# Altium schematic sheet Microcontroller.SchDoc: Micrcontroller (RP2350B)
size B; DrawnBy: Samyar Sadat Akhavi; Revision: 1.0; SheetNumber: 3; SheetTotal: 13
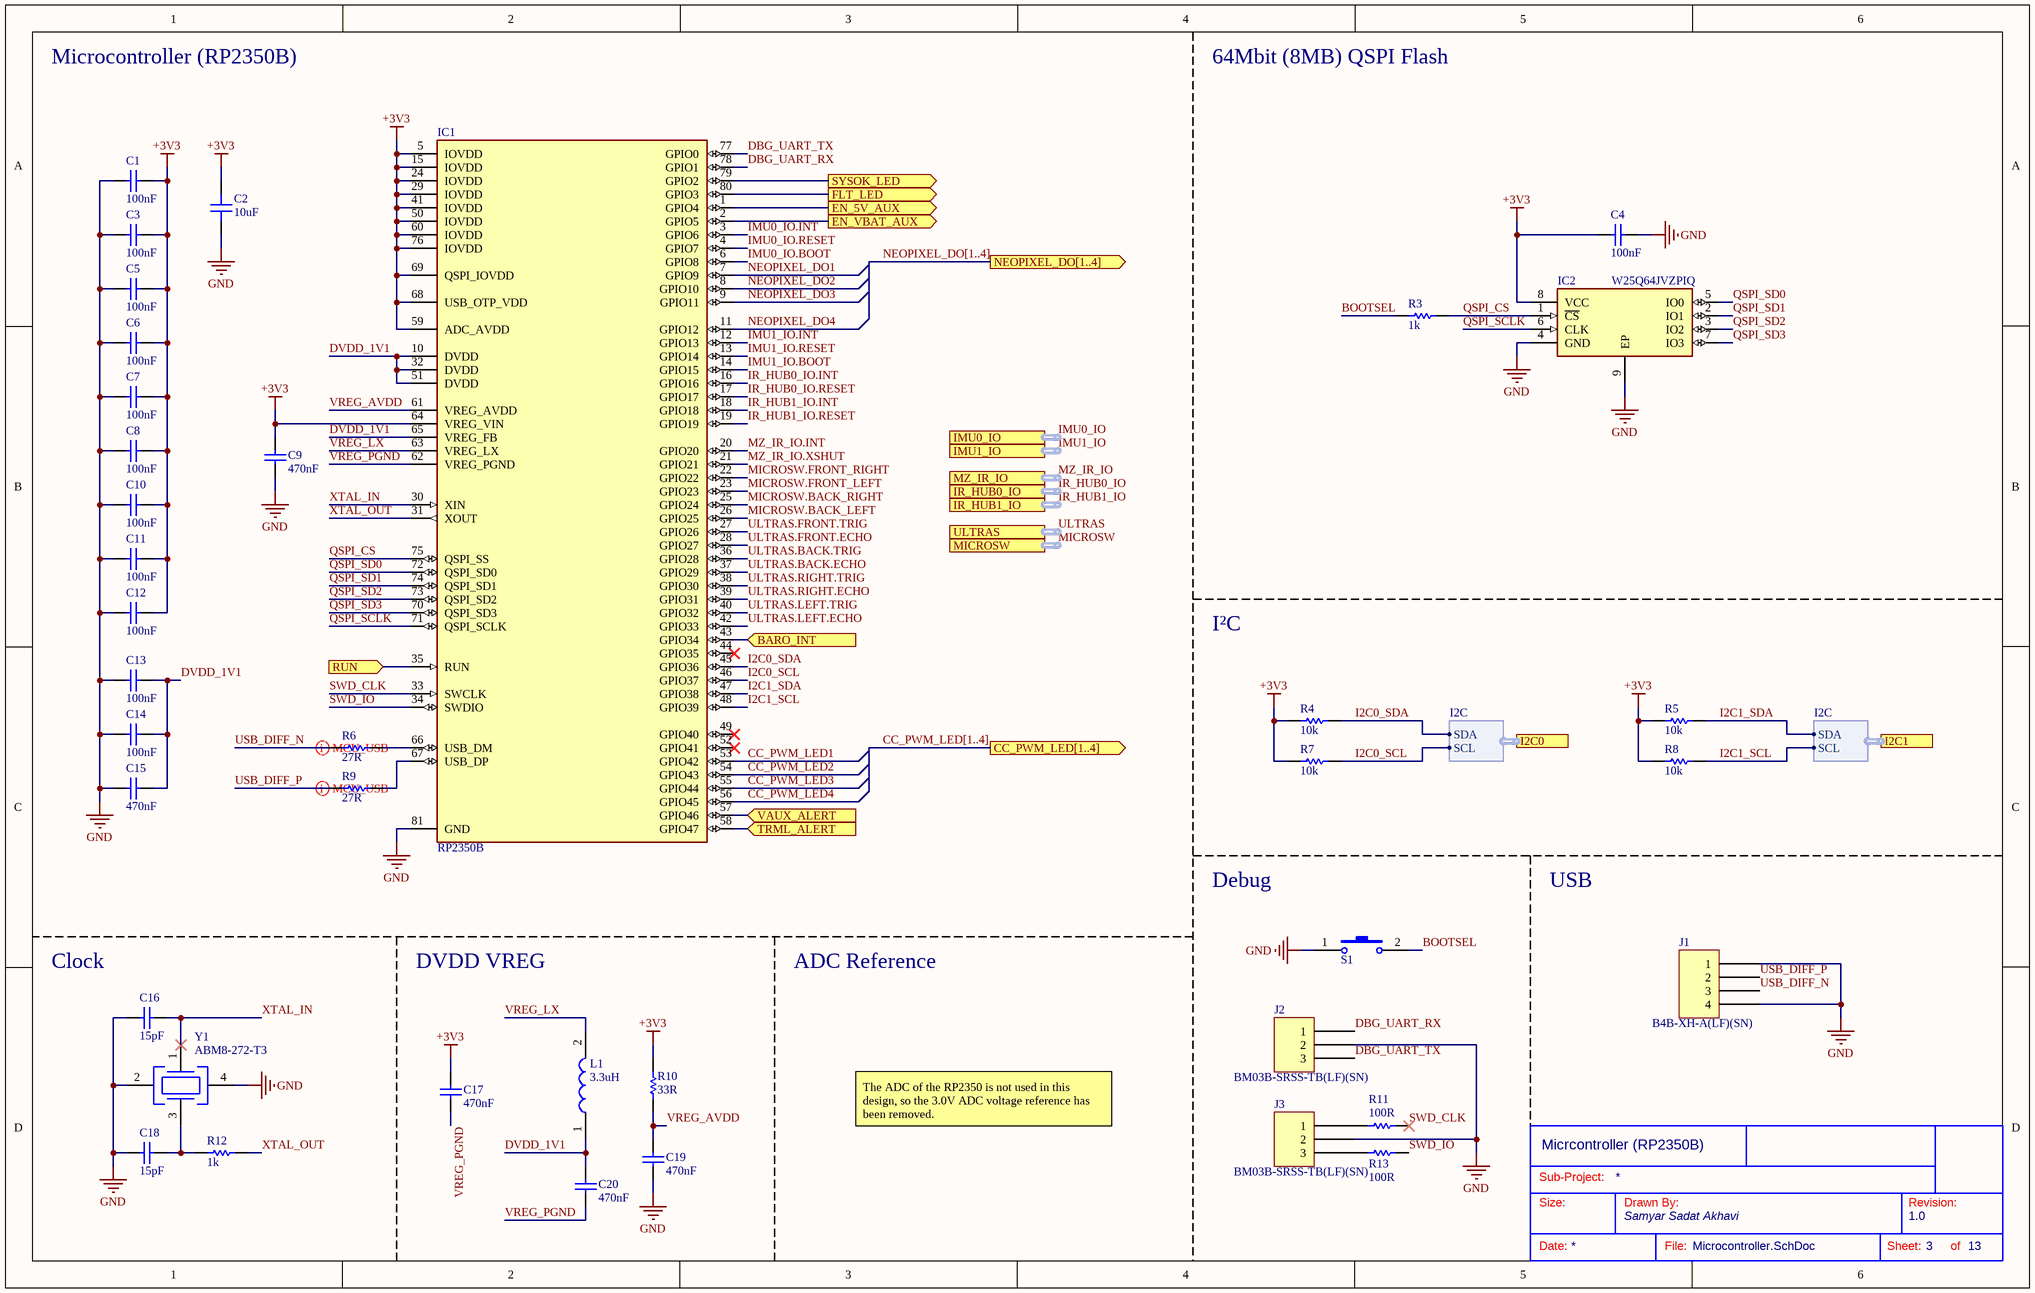
[diagram p0: Microcontroller.SchDoc]

## Parts
?  (no value)  (graphical)
C1  100nF  [CAP 0402_1005]
C2  10uF  [CAP 0805_2012]
C3  100nF  [CAP 0402_1005]
C4  100nF  [CAP_SMD_603]
C5  100nF  [CAP 0402_1005]
C6  100nF  [CAP 0402_1005]
C7  100nF  [CAP 0402_1005]
C8  100nF  [CAP 0402_1005]
C9  470nF  [CAP 0402_1005]
C10  100nF  [CAP 0402_1005]
C11  100nF  [CAP 0402_1005]
C12  100nF  [CAP 0402_1005]
C13  100nF  [CAP 0402_1005]
C14  100nF  [CAP 0402_1005]
C15  470nF  [CAP 0402_1005]
C16  15pF  [CAP 0402_1005]
C17  470nF  [CAP 0402_1005]
C18  15pF  [CAP 0402_1005]
C19  470nF  [CAP 0402_1005]
C20  470nF  [CAP 0402_1005]
IC1  RP2350B  [QFN40P1000X1000X90-81N-D]
IC2  W25Q64JVZPIQ  [SON127P600X500X80-9N-D]
J1  B4B-XH-A(LF)(SN)  [JST XH B4B-XH-A]
J2  BM03B-SRSS-TB(LF)(SN)  [JST BM03B-SRSS-TB]
J3  BM03B-SRSS-TB(LF)(SN)  [JST BM03B-SRSS-TB]
L1  3.3uH  [AOTAB201610S3R3101T]
R3  1k  [RES_0603]
R4  10k  [RES_0603]
R5  10k  [RES_0603]
R6  27R  [RES_0603]
R7  10k  [RES_0603]
R8  10k  [RES_0603]
R9  27R  [RES_0603]
R10  33R  [RES 0402_1005]
R11  100R  [RES_0603]
R12  1k  [RES 0402_1005]
R13  100R  [RES_0603]
S1  PTS815_SJK_250_SMTR_LFS  [PTS815SJK250SMTRLFS]  (value not drawn)
Y1  ABM8-272-T3  [ABM8272T3]

## Ports
BARO_INT (in, see Sensors_IO_Board[2B], Sensors_IO[1D]), CC_PWM_LED[1..4] (out, see Sensors_IO_Board[3B], Lighting[2A]), EN_5V_AUX (out, see Sensors_IO_Board[3A]), EN_VBAT_AUX (out, see Sensors_IO_Board[3A]), FLT_LED (out, see Sensors_IO_Board[3C]), I2C0 (harness I2C, see Sensors_IO_Board[2C], Aux_Power_Bus[4C], Sensors_IO[3C], Thermal[4C]), I2C1 (harness I2C, see Sensors_IO_Board[2B], Sensors_IO[3C], Thermal[4C]), IMU0_IO (harness IMU_IO, see Sensors_IO_Board[2B], Sensors_IO[4C]), IMU1_IO (harness IMU_IO, see Sensors_IO_Board[2B], Sensors_IO[3C]), IR_HUB0_IO (harness TOF_HUB_IO, see Sensors_IO_Board[2B], Sensors_IO[4B]), IR_HUB1_IO (harness ToF_Hub_IO, see Sensors_IO_Board[2B], Sensors_IO[3B]), MICROSW (harness Microswitches, see Sensors_IO_Board[2B], Sensors_IO[3C]), MZ_IR_IO (harness ToF_IO, see Sensors_IO_Board[2B], Sensors_IO[3C]), NEOPIXEL_DO[1..4] (out, see Sensors_IO_Board[3B]), RUN (in, see Sensors_IO_Board[2A]), SYSOK_LED (out, see Sensors_IO_Board[3B]), TRML_ALERT (in, see Sensors_IO_Board[2B], Thermal[4C]), ULTRAS (harness Ultrasonics, see Sensors_IO_Board[2B], Sensors_IO[3D]), VAUX_ALERT (in, see Sensors_IO_Board[3A], Aux_Power_Bus[4C])

## Harnesses
I2C: SDA, SCL

## Nets
+3V3: C1.1 C2.1 C3.1 C4.2 C5.1 C6.1 C7.1 C8.1 C9.2 C10.1 C11.1 C12.1 C17.1 IC1.5(IOVDD) IC1.15(IOVDD) IC1.24(IOVDD) IC1.29(IOVDD) IC1.41(IOVDD) IC1.50(IOVDD) IC1.59(ADC_AVDD) IC1.60(IOVDD) IC1.64(VREG_VIN) IC1.68(USB_OTP_VDD) IC1.69(QSPI_IOVDD) IC1.76(IOVDD) IC2.8(VCC) R4.2 R5.2 R7.2 R8.2 R10.1
GND: C1.2 C2.2 C3.2 C4.1 C5.2 C6.2 C7.2 C8.2 C9.1 C10.2 C11.2 C12.2 C13.1 C14.1 C15.1 C16.1 C18.1 C19.2 IC1.81(GND) IC2.4(GND) IC2.9(EP) J1.1 J1.4 J2.2 J3.2 S1.1(COM) Y1.2(GND_1) Y1.4(GND_2)
BARO_INT: IC1.43(GPIO34) ; port BARO_INT
BOOTSEL: R3.2 S1.2(NO)
CC_PWM_LED1: IC1.53(GPIO42)
CC_PWM_LED2: IC1.54(GPIO43)
CC_PWM_LED3: IC1.55(GPIO44)
CC_PWM_LED4: IC1.56(GPIO45)
DBG_UART_RX: IC1.78(GPIO1) J2.1
DBG_UART_TX: IC1.77(GPIO0) J2.3
DVDD_1V1: C13.2 C14.2 C15.2 C20.1 IC1.10(DVDD) IC1.32(DVDD) IC1.51(DVDD) IC1.65(VREG_FB) L1.1
EN_5V_AUX: IC1.1(GPIO4) ; port EN_5V_AUX
EN_VBAT_AUX: IC1.2(GPIO5) ; port EN_VBAT_AUX
FLT_LED: IC1.80(GPIO3) ; port FLT_LED
I2C0_SCL: IC1.46(GPIO37) R7.1 ; port I2C0.SCL
I2C0_SDA: IC1.45(GPIO36) R4.1 ; port I2C0.SDA
I2C1_SCL: IC1.48(GPIO39) R8.1 ; port I2C1.SCL
I2C1_SDA: IC1.47(GPIO38) R5.1 ; port I2C1.SDA
IMU0_IO.BOOT: IC1.6(GPIO8)
IMU0_IO.INT: IC1.3(GPIO6)
IMU0_IO.RESET: IC1.4(GPIO7)
IMU1_IO.BOOT: IC1.14(GPIO15)
IMU1_IO.INT: IC1.12(GPIO13)
IMU1_IO.RESET: IC1.13(GPIO14)
IR_HUB0_IO.INT: IC1.16(GPIO16)
IR_HUB0_IO.RESET: IC1.17(GPIO17)
IR_HUB1_IO.INT: IC1.18(GPIO18)
IR_HUB1_IO.RESET: IC1.19(GPIO19)
MICROSW.BACK_LEFT: IC1.26(GPIO25)
MICROSW.BACK_RIGHT: IC1.25(GPIO24)
MICROSW.FRONT_LEFT: IC1.23(GPIO23)
MICROSW.FRONT_RIGHT: IC1.22(GPIO22)
MZ_IR_IO.INT: IC1.20(GPIO20)
MZ_IR_IO.XSHUT: IC1.21(GPIO21)
NEOPIXEL_DO1: IC1.7(GPIO9)
NEOPIXEL_DO2: IC1.8(GPIO10)
NEOPIXEL_DO3: IC1.9(GPIO11)
NEOPIXEL_DO4: IC1.11(GPIO12)
QSPI_CS: IC1.75(QSPI_SS) IC2.1(~{CS}) R3.1
QSPI_SCLK: IC1.71(QSPI_SCLK) IC2.6(CLK)
QSPI_SD0: IC1.72(QSPI_SD0) IC2.5(IO0)
QSPI_SD1: IC1.74(QSPI_SD1) IC2.2(IO1)
QSPI_SD2: IC1.73(QSPI_SD2) IC2.3(IO2)
QSPI_SD3: IC1.70(QSPI_SD3) IC2.7(IO3)
RUN: IC1.35(RUN) ; port RUN
SWD_CLK: IC1.33(SWCLK) R11.1
SWD_IO: IC1.34(SWDIO) R13.1
SYSOK_LED: IC1.79(GPIO2) ; port SYSOK_LED
TRML_ALERT: IC1.58(GPIO47) ; port TRML_ALERT
ULTRAS.BACK.ECHO: IC1.37(GPIO29)
ULTRAS.BACK.TRIG: IC1.36(GPIO28)
ULTRAS.FRONT.ECHO: IC1.28(GPIO27)
ULTRAS.FRONT.TRIG: IC1.27(GPIO26)
ULTRAS.LEFT.ECHO: IC1.42(GPIO33)
ULTRAS.LEFT.TRIG: IC1.40(GPIO32)
ULTRAS.RIGHT.ECHO: IC1.39(GPIO31)
ULTRAS.RIGHT.TRIG: IC1.38(GPIO30)
USB_DIFF_N: J1.3 R6.1
USB_DIFF_P: J1.2 R9.1
VAUX_ALERT: IC1.57(GPIO46) ; port VAUX_ALERT
VREG_AVDD: C19.1 IC1.61(VREG_AVDD) R10.2
VREG_LX: IC1.63(VREG_LX) L1.2
VREG_PGND: C17.2 C20.2 IC1.62(VREG_PGND)
XTAL_IN: C16.2 IC1.30(XIN) Y1.1(CRYSTAL_1)
XTAL_OUT: IC1.31(XOUT) R12.2
NetC18_2: C18.2 R12.1 Y1.3(CRYSTAL_2)
NetIC1_66: IC1.66(USB_DM) R6.2
NetIC1_67: IC1.67(USB_DP) R9.2
NetJ3_1: J3.1 R11.2
NetJ3_3: J3.3 R13.2

Not connected (* = marked no-connect by the designer): IC1 44(GPIO35)* 49(GPIO40)* 52(GPIO41)*

## Buses and harness runs
bus CC_PWM_LED[1..4] = port CC_PWM_LED[1..4]
bus NEOPIXEL_DO[1..4] = port NEOPIXEL_DO[1..4]
harness IMU0_IO = port IMU0_IO
harness IMU1_IO = port IMU1_IO
harness IR_HUB0_IO = port IR_HUB0_IO
harness IR_HUB1_IO = port IR_HUB1_IO
harness MICROSW = port MICROSW
harness MZ_IR_IO = port MZ_IR_IO
harness ULTRAS = port ULTRAS

## Layout directives
differential pair: USB_DIFF_N, USB_DIFF_P

## Notes on the sheet
- Microcontroller (RP2350B)
- 64Mbit (8MB) QSPI Flash
- I²C
- Debug
- USB
- Clock
- DVDD VREG
- ADC Reference
- The ADC of the RP2350 is not used in this design, so the 3.0V ADC voltage reference has been removed.
- Sub-Project:
- Size:
- Drawn By:
- Revision:
- Date:
- File:
- Sheet:
- of

## Library data of the parts
? = Standard Title Block
C1 C3-C20 = Non-polar Capacitor: Generic Ceramic Capacitor; Voltage: 6.3V
  C1 C3-C8 C10-C14: Value: 100nF
  C9 C15 C17 C19 C20: Value: 470nF
  C16 C18: Value: 15pF
C2 = CL21A106KOQNNNE: CAP CER 10UF 16V X5R 0805; manufacturer: Samsung Electro-Mechanics; Capacitance: 10 µF; Tolerance: ±10%; Part Number: CL21A106KOQNNNE; Applications: General Purpose; componentlink1description: Datasheet; componentlink1url: http://www.samsungsem.com/kr/support/product-search/mlcc/CL21A106KOQNNNE.jsp; componentlink2description: DigiKey Link; componentlink2url: https://www.digikey.com/en/products/detail/samsung-electro-mechanics/CL21A106KOQNNNE/3886754; Device Package: 0805 (2012 Metric); lastupdated: 2/9/2024 8:15:37 PM; Lifecycle Status: Active; Minimum Order: 1; Mounting Type: Surface Mount, MLCC; Operating Temperature: -55°C ~ 85°C; Package / Case: 0805 (2012 Metric); packaging: TapeAndReel; partid: 14297; Part Status: Active; price: 0.01; series: CL; Size / Dimension: 0.079" L x 0.049" W (2.00mm x 1.25mm); Supplier 1: DigiKey; Supplier Part Number 1: 1276-1096-1-ND; Temperature Coefficient: X5R; Thickness (Max): 0.055" (1.40mm); value: 10uF; Voltage - Rated: 16V
IC1 = RP2350B: Integrated Circuit; Manufacturer_Name: RASPBERRY-PI; Datasheet Link: https://datasheets.raspberrypi.com/rp2350/rp2350-product-brief.pdf; Height: 0.9mm; Manufacturer_Part_Number: RP2350B
IC2 = W25Q64JVZPIQ: Integrated Circuit; Manufacturer_Name: Winbond; Datasheet Link: https://www.winbond.com/hq/search-resource-file.jsp?partNo=W25Q64JVZPIQ&type=datasheet; Height: 0.8mm; Manufacturer_Part_Number: W25Q64JVZPIQ; Mouser Part Number: 454-W25Q64JVZPIQ; Mouser Price/Stock: https://www.mouser.co.uk/ProductDetail/Winbond/W25Q64JVZPIQ?qs=qSfuJ%252Bfl%2Fd7Nj8XAKQ%2FzKA%3D%3D; Arrow Part Number: W25Q64JVZPIQ; Arrow Price/Stock: https://www.arrow.com/en/products/w25q64jvzpiq/winbond-electronics?utm_currency=USD&region=nac
J1 = B4B-XH-A(LF)(SN): CONN HEADER VERT 4POS 2.5MM; Manufacturer: JST Sales America Inc.; Contact Length - Post: 0.134" (3.40mm); Current Rating (Amps): 3A; Material Flammability Rating: UL94 V-0; Number of Positions: 4; Number of Positions Loaded: All; Pitch - Mating: 0.098" (2.50mm); Shrouding: Shrouded - 4 Wall; Style: Board to Cable/Wire; Voltage Rating: 250V; System: Connector; Part Number: B4B-XH-A(LF)(SN); ComponentLink1Description: Datasheet; ComponentLink1URL: http://www.jst-mfg.com/product/pdf/eng/eXH.pdf; ComponentLink2Description: DigiKey Link; ComponentLink2URL: http://digikey.com/product-detail/en/jst-sales-america-inc/B4B-XH-A-LF-SN/455-2249-ND/1651047; Connector Type: Header; Contact Finish - Mating: Tin; Contact Finish - Post: Tin; Contact Material: Brass; Contact Shape: Square; Contact Type: Male Pin; Fastening Type: Detent Lock; Insulation Color: Natural; Insulation Height: 0.276" (7.00mm); Insulation Material: Polyamide (PA66), Nylon 6/6; LastUpdated: 1/12/2020 11:46:34 PM; Lifecycle Status: Active; Minimum Order: 1; Mounting Type: Through Hole; Number of Rows: 1; Operating Temperature: -25°C ~ 85°C; Packaging: Bulk; PartId: 69; Part Status: Active; Price: 0.21; Series: XH; Supplier 1: DigiKey; Supplier Part Number 1: 455-2249-ND; Termination: Press-Fit, Solder
J2 J3 = BM03B-SRSS-TB(LF)(SN): CONN HEADER SMD 3POS 1MM; Manufacturer: JST Sales America Inc.; Current Rating (Amps): 0.7A; Material Flammability Rating: UL94 V-0; Number of Positions: 3; Number of Positions Loaded: All; Pitch - Mating: 0.039" (1.00mm); Shrouding: Shrouded - 4 Wall; Style: Board to Cable/Wire; Voltage Rating: 50V; Part Number: BM03B-SRSS-TB(LF)(SN); ComponentLink1Description: Datasheet; ComponentLink1URL: http://www.jst-mfg.com/product/pdf/eng/eSR.pdf; ComponentLink2Description: DigiKey Link; ComponentLink2URL: http://digikey.com/product-detail/en/jst-sales-america-inc/BM03B-SRSS-TB-LF-SN/455-1789-1-ND/926860; Connector Type: Header; Contact Finish - Mating: Tin; Contact Finish - Post: Tin; Contact Material: Copper Alloy; Contact Shape: Square; Contact Type: Male Pin; Fastening Type: Push-Pull; Features: Solder Retention; Insulation Color: Natural; Insulation Height: 0.167" (4.25mm); Insulation Material: Polyamide (PA), Nylon; LastUpdated: 1/12/2020 10:12:14 PM; Lifecycle Status: Active; Minimum Order: 1; Mounting Type: Surface Mount; Number of Rows: 1; Operating Temperature: -25°C ~ 85°C; Packaging: TapeAndReel; PartId: 14; Part Status: Active; Price: 0.24; Series: SR; Supplier 1: DigiKey; Supplier Part Number 1: 455-1789-1-ND; Termination: Solder
L1 = AOTA-B201610S3R3-101-T: Inductor; Manufacturer_Name: ABRACON; Datasheet Link: https://abracon.com/datasheets/AOTA-B201610S3R3-101-T.pdf; Height: 1mm; Manufacturer_Part_Number: AOTA-B201610S3R3-101-T; Mouser Part Number: 815-AB201610S3R3101T; Mouser Price/Stock: https://www.mouser.co.uk/ProductDetail/ABRACON/AOTA-B201610S3R3-101-T?qs=%252BXxaIXUDbq0IZvJW%2F2mv4w%3D%3D; Arrow Part Number: AOTA-B201610S3R3-101-T; Arrow Price/Stock: https://www.arrow.com/en/products/aota-b201610s3r3-101-t/abracon?utm_currency=USD&region=nac
R3-R5 R7 R8 R11 R13 = Resistor: Power: 1/8W
  R3: Value: 1k
  R4 R5 R7 R8: Value: 10k
  R11 R13: Value: 100R
R6 R9 R10 R12 = Resistor: Generic Resistor; Power: 1/8W
  R6 R9: Value: 27R
  R10: Value: 33R
  R12: Value: 1k
S1 = PTS815_SJK_250_SMTR_LFS: Switch; Manufacturer_Name: C & K COMPONENTS; Manufacturer_Part_Number: PTS815 SJK 250 SMTR LFS; Datasheet Link: https://www.mouser.com/datasheet/2/60/pts815-1535658.pdf; Height: 2mm; Mouser Part Number: 611-PTS815SJK250SMTR; Mouser Price/Stock: https://www.mouser.co.uk/ProductDetail/CK/PTS815-SJK-250-SMTR-LFS?qs=ahcBuItHZ3yETpGYMHf%2FgQ%3D%3D; Arrow Part Number: PTS815 SJK 250 SMTR LFS; Arrow Price/Stock: https://www.arrow.com/en/products/pts815-sjk-250-smtr-lfs/ck
Y1 = ABM8-272-T3: Crystal or Oscillator; Manufacturer_Name: ABRACON; Datasheet Link: https://abracon.com/datasheets/ABM8-272-T3.pdf; Height: 0.8mm; Manufacturer_Part_Number: ABM8-272-T3; Mouser Part Number: 815-ABM8-272-T3; Mouser Price/Stock: https://www.mouser.co.uk/ProductDetail/ABRACON/ABM8-272-T3?qs=QpmGXVUTftEj6miOiJBMxQ%3D%3D